# EasyEDA Pro project ProPrj_主车电路板.epro, schematic 12V&步进驱动&CAN收发
Board Name: 12V&步进驱动&CAN收发; Create Date: 2025-03-30; Page Name: P1; Project Name: 主车电路板3.0; Schematic Name: 12V&步进驱动&CAN收发; Update Date: 2025-04-13; Company: 嘉立创EDA; Drawed: 李子晞; Page Size: A4; Version: V1.0
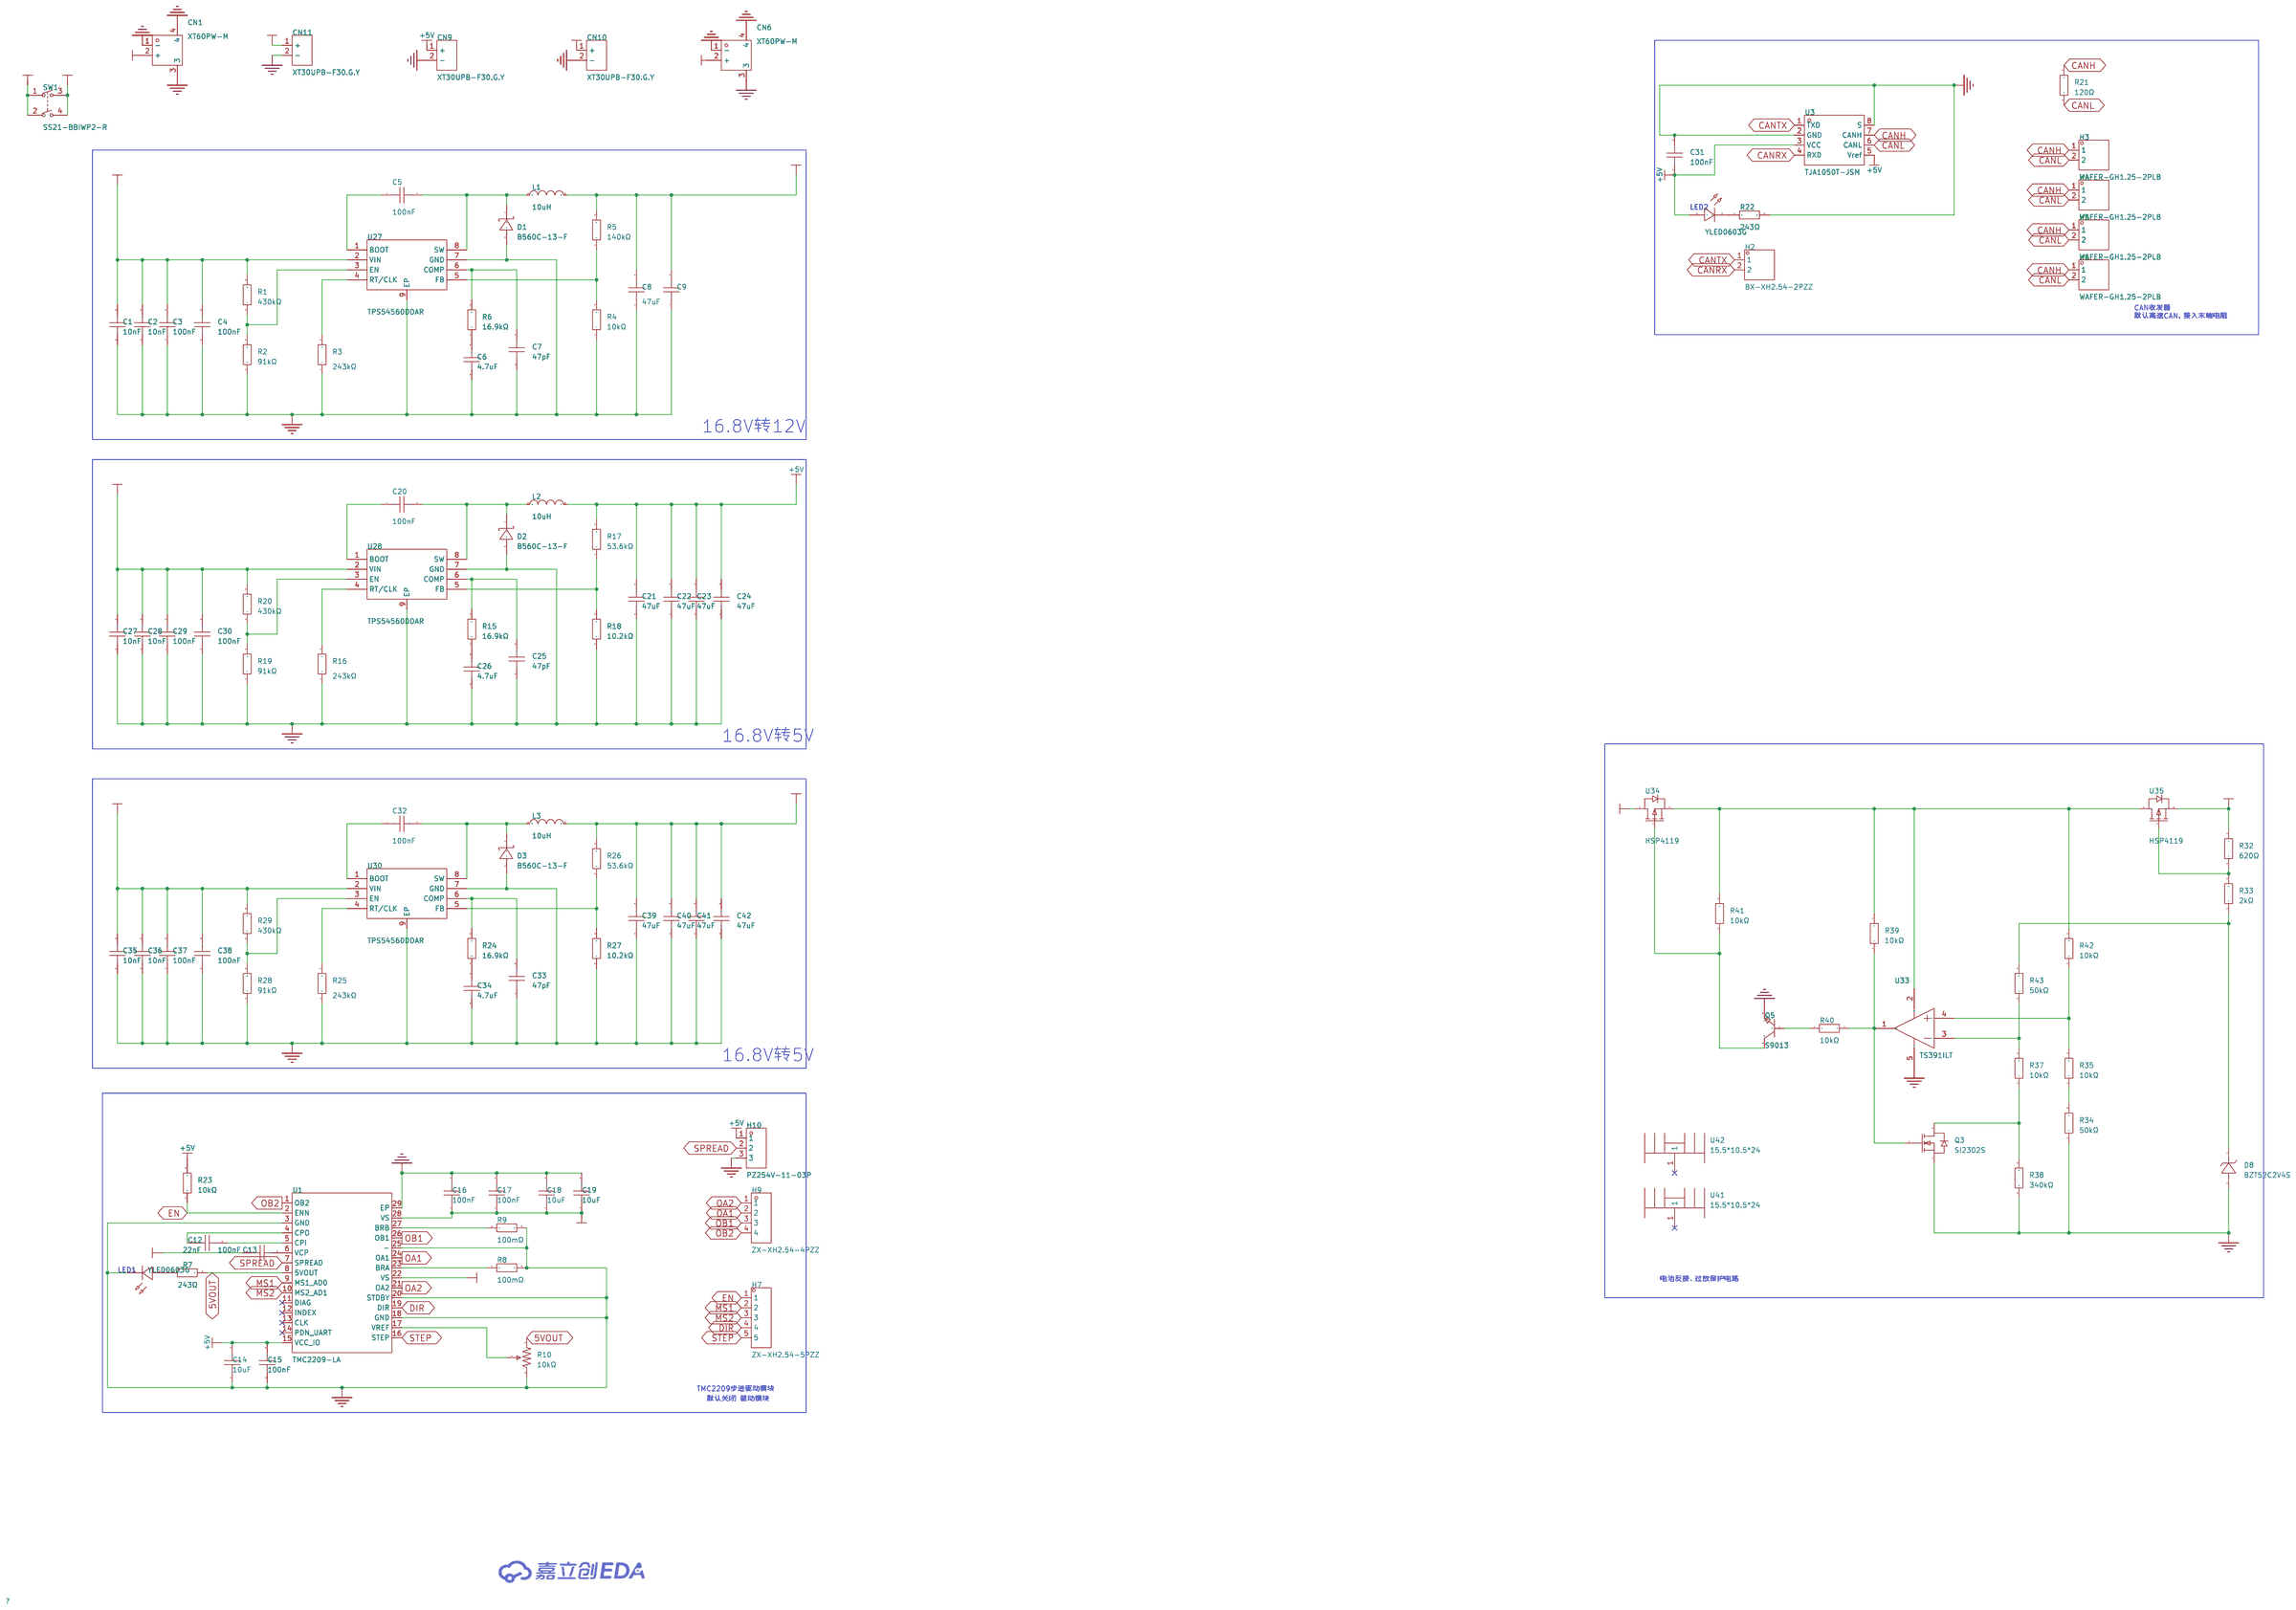
[diagram p0: schematic sheet]

## Parts
C1  10nF  [C0805]
C2  10nF  [C0805]
C3  100nF  [C0805]
C4  100nF  [C0805]
C5  100nF  [C0805]
C6  4.7uF  [C0805]
C7  47pF  [C0805]
C8  47uF  [CAP-SMD_BD6.3-L6.6-W6.6-LS7.2-FD]
C9  47uF  [CAP-SMD_BD6.3-L6.6-W6.6-LS7.2-FD]
C12  22nF  [C0805]
C13  100nF  [C0805]
C14  10uF  [C0805]
C15  100nF  [C0805]
C16  100nF  [C0805]
C17  100nF  [C0805]
C18  10uF  [C0805]
C19  10uF  [C0805]
C20  100nF  [C0805]
C21  47uF  [C1206]
C22  47uF  [C1206]
C23  47uF  [C1206]
C24  47uF  [C1206]
C25  47pF  [C0805]
C26  4.7uF  [C0805]
C27  10nF  [C0805]
C28  10nF  [C0805]
C29  100nF  [C0805]
C30  100nF  [C0805]
C31  100nF  [C0805]
C32  100nF  [C0805]
C33  47pF  [C0805]
C34  4.7uF  [C0805]
C35  10nF  [C0805]
C36  10nF  [C0805]
C37  100nF  [C0805]
C38  100nF  [C0805]
C39  47uF  [C1206]
C40  47uF  [C1206]
C41  47uF  [C1206]
C42  47uF  [C1206]
CN1  XT60PW-M  [CONN-TH_XT60PW-M]
CN6  XT60PW-M  [CONN-TH_XT60PW-M]
CN9  XT30UPB-F30.G.Y  [CONN-TH_XT30UPB-F]
CN10  XT30UPB-F30.G.Y  [CONN-TH_XT30UPB-F]
CN11  XT30UPB-F30.G.Y  [CONN-TH_XT30UPB-F]
D1  B560C-13-F  [SMC_L7.1-W6.2-LS8.1-RD]
D2  B560C-13-F  [SMC_L7.1-W6.2-LS8.1-RD]
D3  B560C-13-F  [SMC_L7.1-W6.2-LS8.1-RD]
D8  BZT52C2V4S  [SOD-323_L1.9-W1.3-LS2.5-RD-1]
H2  BX-XH2.54-2PZZ  [CONN-TH_2P-P2.50_BX-XH2.54-2PZZ]
H3  WAFER-GH1.25-2PLB  [CONN-TH_2P-P1.25_XUNPU_WAFER-GH1.25-2PLB]
H4  WAFER-GH1.25-2PLB  [CONN-TH_2P-P1.25_XUNPU_WAFER-GH1.25-2PLB]
H5  WAFER-GH1.25-2PLB  [CONN-TH_2P-P1.25_XUNPU_WAFER-GH1.25-2PLB]
H6  WAFER-GH1.25-2PLB  [CONN-TH_2P-P1.25_XUNPU_WAFER-GH1.25-2PLB]
H7  ZX-XH2.54-5PZZ  [CONN-TH_5P-P2.50_ZX-XH2.54-5PZZ]
H9  ZX-XH2.54-4PZZ  [CONN-TH_4P-P2.50_4PIN]
H10  PZ254V-11-03P  [HDR-TH_3P-P2.54-V-M]
L1  10uH  [IND-SMD_L7.3-W6.8]
L2  10uH  [IND-SMD_L7.3-W6.8]
L3  10uH  [IND-SMD_L7.3-W6.8]
LED1  YLED0603G  [LED0603-FD]
LED2  YLED0603G  [LED0603-FD]
Q3  SI2302S  [SOT-23-3_L2.9-W1.3-P1.90-LS2.4-BR]
Q5  S9013  [SOT-23-3_L2.9-W1.3-P0.95-LS2.4-BR]
R1  430kΩ  [R0805]
R2  91kΩ  [R0805]
R3  243kΩ  [R0805]
R4  10kΩ  [R0805]
R5  140kΩ  [R0805]
R6  16.9kΩ  [R0805]
R7  243Ω  [R0805]
R8  100mΩ  [R0805]
R9  100mΩ  [R0805]
R10  10kΩ  [RES-ADJ-SMD_3P-L3.0-W3.8-P1.75-BR]
R15  16.9kΩ  [R0805]
R16  243kΩ  [R0805]
R17  53.6kΩ  [R0805]
R18  10.2kΩ  [R0805]
R19  91kΩ  [R0805]
R20  430kΩ  [R0805]
R21  120Ω  [R0805]
R22  243Ω  [R0805]
R23  10kΩ  [R0805]
R24  16.9kΩ  [R0805]
R25  243kΩ  [R0805]
R26  53.6kΩ  [R0805]
R27  10.2kΩ  [R0805]
R28  91kΩ  [R0805]
R29  430kΩ  [R0805]
R32  620Ω  [R0805]
R33  2kΩ  [R0805]
R34  50kΩ  [R0805]
R35  10kΩ  [R0805]
R37  10kΩ  [R0805]
R38  340kΩ  [R0805]
R39  10kΩ  [R0805]
R40  10kΩ  [R0805]
R41  10kΩ  [R0805]
R42  10kΩ  [R0805]
R43  50kΩ  [R0805]
SW1  SS21-BBIWP2-R  [SW-TH_SS21-BBIWP2]
U1  TMC2209-LA  [QFN-28_L5.0-W5.0-P0.50-BL-EP]
U3  TJA1050T-JSM  [SOIC-8_L4.9-W3.9-P1.27-LS6.0-BL]
U27  TPS54560DDAR  [SOIC-8_L5.0-W4.0-P1.27-LS6.0-BL-EP2.0]
U28  TPS54560DDAR  [SOIC-8_L5.0-W4.0-P1.27-LS6.0-BL-EP2.0]
U30  TPS54560DDAR  [SOIC-8_L5.0-W4.0-P1.27-LS6.0-BL-EP2.0]
U33  TS391ILT  [SOT-23-5_L3.0-W1.7-P0.95-LS2.8-BR]
U34  HSP4119  [TO-220-3_L10.2-W4.5-P2.54-L]
U35  HSP4119  [TO-220-3_L10.2-W4.5-P2.54-L]
U41  15.5*10.5*24  [HEATSINK-TH_L15.5-W10.5-XSD1226-005]
U42  15.5*10.5*24  [HEATSINK-TH_L15.5-W10.5-XSD1226-005]

## Library data of the parts
C1 C2 C27 C28 C35 C36 = CC0805KRX7R9BB103: 容值:10nF;精度:±10%;额定电压:50V;材质(温度系数):X7R;; LCSC Part Name: 10nF ±10% 50V; Supplier Part: C83170; Manufacturer: YAGEO(国巨); Supplier Footprint: 0805; JLCPCB Part Class: Extended Part; Datasheet: https://atta.szlcsc.com/upload/public/pdf/source/20170211/1486785656773.pdf; Supplier: LCSC; Tolerance: ±10%; Voltage Rated: 50V; Temperature Coefficient: X7R
C3 C4 C13 C15-C17 C20 C29-C32 C37 C38 = CC0805KRX7R9BB104: 容值:100nF;精度:±10%;额定电压:50V;材质(温度系数):X7R;; LCSC Part Name: 100nF ±10% 50V; Supplier Part: C49678; Manufacturer: YAGEO(国巨); Supplier Footprint: 0805; JLCPCB Part Class: Basic Part; Datasheet: https://atta.szlcsc.com/upload/public/pdf/source/20180224/C181747_15194369449651363981.pdf; Supplier: LCSC; Tolerance: ±10%; Voltage Rated: 50V; Temperature Coefficient: X7R
C5 = CC0805JRX7R9BB104: 容值:100nF;精度:±5%;额定电压:50V;材质(温度系数):X7R;; LCSC Part Name: 100nF ±5% 50V; Supplier Part: C111492; Manufacturer: YAGEO(国巨); Supplier Footprint: 0805; JLCPCB Part Class: Extended Part; Datasheet: https://atta.szlcsc.com/upload/public/pdf/source/20170712/C111492_1499832266087814220.pdf; Supplier: LCSC; Tolerance: ±5%; Voltage Rated: 50V; Temperature Coefficient: X7R
C6 = CC0805KKX5R9BB475: 容值:4.7uF;精度:±10%;额定电压:50V;材质(温度系数):X5R;; LCSC Part Name: 4.7uF ±10% 50V; Supplier Part: C2897302; Manufacturer: YAGEO(国巨); Supplier Footprint: 0805; JLCPCB Part Class: Extended Part; Datasheet: https://atta.szlcsc.com/upload/public/pdf/source/20240708/74D7CC2672B7CD71C30ED4CACAE97037.pdf; Supplier: LCSC; Tolerance: ±10%; Voltage Rated: 50V; Temperature Coefficient: X5R
C7 C25 C33 = CC0805JRNPO9BN470: 容值:47pF;精度:±5%;额定电压:50V;材质(温度系数):NP0;; LCSC Part Name: 47pF ±5% 50V; Supplier Part: C107118; Manufacturer: YAGEO(国巨); Supplier Footprint: 0805; JLCPCB Part Class: Extended Part; Datasheet: https://atta.szlcsc.com/upload/public/pdf/source/20181008/C309499_21CC21451B82C39E3D92150FD6B30293.pdf; Supplier: LCSC; Tolerance: ±5%; Voltage Rated: 50V; Temperature Coefficient: NP0
C8 C9 = RVT47UF35V67RV0039: 容值:47uF;精度:±20%;额定电压:35V;纹波电流:16.4mA@120Hz;等效串联电阻(ESR):-;; LCSC Part Name: 47uF ±20% 35V; Supplier Part: C2836440; Manufacturer: KNSCHA(科尼盛); Supplier Footprint: SMD,D6.3xL5.4mm; JLCPCB Part Class: Extended Part; Datasheet: https://atta.szlcsc.com/upload/public/pdf/source/20210528/C2836440_FB61BB3A7A46B9CC2A608A35871DBF0C.pdf; Supplier: LCSC; Tolerance: ±20%; Voltage Rating: 35V; Ripple Current: 16.4mA@120Hz; Diameter: 6.3mm; Height - Seated (Max): 5.4mm; Lifetime: 2000hrs@105℃; Operating Temperature: -55℃~+105℃
C12 = CC0805KRX7R9BB223: 容值:22nF;精度:±10%;额定电压:50V;材质(温度系数):X7R;; LCSC Part Name: 22nF ±10% 50V; Supplier Part: C107147; Manufacturer: YAGEO(国巨); Supplier Footprint: 0805; JLCPCB Part Class: Extended Part; Datasheet: https://atta.szlcsc.com/upload/public/pdf/source/20170914/C128857_1505359892143968080.pdf; Supplier: LCSC; Tolerance: ±10%; Voltage Rated: 50V; Temperature Coefficient: X7R
C14 C18 C19 = CC0805KKX5R8BB106_C89831: 容值:10uF;精度:±10%;额定电压:25V;材质(温度系数):X5R;; LCSC Part Name: 10uF ±10% 25V; Supplier Part: C89831; Manufacturer: YAGEO(国巨); Manufacturer Part: CC0805KKX5R8BB106; Supplier Footprint: 0805; JLCPCB Part Class: Extended Part; Datasheet: https://atta.szlcsc.com/upload/public/pdf/source/20180403/C190190_A1AA8A0854FDD509EBDBDAD022A1C1DB.pdf; Supplier: LCSC; Tolerance: ±10%; Voltage Rated: 25V; Temperature Coefficient: X5R
C21-C24 C39-C42 = TCC1206X5R476M100HT: 容值:47uF;精度:±20%;额定电压:10V;温度系数:X5R;; LCSC Part Name: 47uF ±20% 10V; Supplier Part: C5448950; Manufacturer: CCTC(三环); Supplier Footprint: 1206; JLCPCB Part Class: Extended Part; Datasheet: https://atta.szlcsc.com/upload/public/pdf/source/20240328/884AC395F30D87665FEB597BCA413C3A.pdf; Supplier: LCSC; Tolerance: ±20%; Voltage Rating: 10V; Temperature Coefficient: X5R
C26 C34 = CGA0805X7R475K350MT: 容值:4.7uF;精度:±10%;额定电压:35V;材质(温度系数):X7R;; LCSC Part Name: 4.7uF ±10% 35V; Supplier Part: C6119943; Manufacturer: HRE(芯声); Supplier Footprint: 0805; JLCPCB Part Class: Extended Part; Supplier: LCSC; Tolerance: ±10%; Voltage Rated: 35V; Temperature Coefficient: X7R
CN1 CN6 = XT60PW-M: 类别:-;类型1:-;; LCSC Part Name: AMASS(艾迈斯)航模插头xt60连接器150公母对接pw锂电池公头 板插卧式XT60PW-M; Supplier Part: C98732; Manufacturer: AMASS(艾迈斯); JLCPCB Part Class: 扩展库; Datasheet: https://atta.szlcsc.com/upload/public/pdf/source/20240118/44A3DCFF53BE25DC65378AFFB21277A4.pdf; Supplier: LCSC; Brand: 艾迈斯; Type: 卧式插头; Colour: 黄色; InterfaceType: 公头
CN9-CN11 = XT30UPB-F30.G.Y: 类别:-;类型1:-;; LCSC Part Name: AMASS(艾迈斯)直立焊板式连接器XT30UPB30-F.G.*; Supplier Part: C108769; Manufacturer: AMASS(艾迈斯); JLCPCB Part Class: 扩展库; Datasheet: https://atta.szlcsc.com/upload/public/pdf/source/20220715/AFD68B9E8B6CA95A7295DBF4AF9325E4.pdf; Supplier: LCSC; Brand: 艾迈斯; Type: 航模插头; Colour: 黄色; RatedVoltage: DC 500V; InterfaceType: 母头; MetalMaterial: 镀金; InsulationMaterial: PA; RatedCurrent: 15A; contact resistance: 0.65mΩ
D1-D3 = B560C-13-F: 正向压降(Vf):700mV@5A;直流反向耐压(Vr):60V;整流电流:5A;; LCSC Part Name: 电压:60V 电流:5A; Supplier Part: C85100; Manufacturer: DIODES(美台); Supplier Footprint: SMC(DO-214AB); JLCPCB Part Class: 扩展库; Datasheet: https://atta.szlcsc.com/upload/public/pdf/source/20171023/C134461_15087453602301052556.pdf; Supplier: LCSC; Forward Voltage (Vf@If): 700mV@5A; Reverse Voltage (Vr): 60V; Rectified Current: 5A; Reverse Leakage Current (Ir): 500uA@60V
D8 = BZT52C2V4S_C22375290: 二极管配置:独立式;稳压值(标称值):2.4V;稳压值(范围):2.2V~2.6V;功率(Pd):200mW;; Supplier Part: C22375290; Manufacturer: 宏迦橙; Supplier Footprint: SOD-323; JLCPCB Part Class: 扩展库; Datasheet: https://atta.szlcsc.com/upload/public/pdf/source/20240429/5D32C25DF9220690D27DBBD9463ECD1D.pdf; Supplier: LCSC; Diode Configuration: 独立式; Zener Voltage (Nom): 2.4V; Reverse Leakage Current (Ir): 50uA@1V; Zener Voltage (Range): 2.2V~2.6V; Power Dissipation: 200mW; Zener Impedance (Zzt): 100Ω
H2 = BX-XH2.54-2PZZ: 插针结构:1x2P;间距:2.5mm;安装方式:直插;参考系列:XH;总PIN数:2P;排数:1;每排PIN数:2;行距:-;额定电流:3A;触头材质:黄铜;触头镀层:锡;工作温度:-25℃~+85℃;; LCSC Part Name: 1x2P 间距:2.5mm 直插 系列:XH; Supplier Part: C18077833; Manufacturer: Bossie(博锡); Supplier Footprint: 插件,P=2.54mm; JLCPCB Part Class: Extended Part; Datasheet: https://atta.szlcsc.com/upload/public/pdf/source/20231017/CB25E46A13930659CD6CDE2F2553A508.pdf; Supplier: LCSC; Pins Structure: 1x2P; Pitch: 2.5mm; Mounting Type: 直插; Reference Series: XH; Number of Pins: 2P; Number of Rows: 1; Number of PINs Per Row: 2; Current Rating: 3A; Contact Material: 黄铜; Contact Plating: 锡; Operating Temperature: -25℃~+85℃; Voltage Rating: 250V; Plastic Material: PA66; Flame Retardant Rating: UL94V-0; Color: 白色; Z-Height of the Board: 7mm; X-Length of Bottom Edge on Board (Spacing Line): 7.5mm; Y-Width of Bottom Edge on Board: 5.9mm
H3-H6 = WAFER-GH1.25-2PLB: 插针结构:1x2P;间距:1.25mm;安装方式:立贴;参考系列:GH;总PIN数:2P;排数:1;每排PIN数:2;行距:-;额定电流:1A;触头材质:黄铜;触头镀层:-;工作温度范围:-25℃~+85℃;; LCSC Part Name: 1x2P 间距:1.25mm 立贴 系列:GH; Supplier Part: C3029368; Manufacturer: XUNPU(讯普); Supplier Footprint: SMD,P=1.25mm; JLCPCB Part Class: Extended Part; Datasheet: https://atta.szlcsc.com/upload/public/pdf/source/20220527/44F824AAC8C2B617205E15955FF9C23D.pdf; Supplier: LCSC; Pins Structure: 1x2P; Pitch: 1.25mm; Mounting Type: 立贴; Reference Series: GH; Number of Pins: 2P; Number of Rows: 1; Number of PINs Per Row: 2; Current Rating: 1A; Contact Material: 黄铜; Operating Temperature: -25℃~+85℃; Voltage Rating: 125V; Plastic Material: LCP; Supplementary Features: 辅助焊脚; Color: 米色; Z-Height of the Board: 4.2mm; X-Length of Bottom Edge on Board (Spacing Line): 5.75mm; Y-Width of Bottom Edge on Board: 4.95mm
H7 = ZX-XH2.54-5PZZ: 插针结构:1x5P;间距:2.5mm;安装方式:直插;参考系列:XH;总PIN数:5P;排数:1;每排PIN数:5;行距:-;额定电流:3A;触头材质:黄铜;触头镀层:锡;工作温度范围:-25℃~+85℃;; LCSC Part Name: 1x5P 间距:2.5mm 直插 系列:XH; Supplier Part: C7429635; Manufacturer: Megastar(兆星); Supplier Footprint: 插件,P=2.5mm; JLCPCB Part Class: Extended Part; Datasheet: https://atta.szlcsc.com/upload/public/pdf/source/20230619/60EEF4ADD558E90BFFACF5D939816781.pdf; Supplier: LCSC; Pins Structure: 1x5P; Pitch: 2.5mm; Mounting Type: 直插; Reference Series: XH; Number of Pins: 5P; Number of Rows: 1; Number of PINs Per Row: 5; Rated Current: 3A; Contact Material: 黄铜; Contact Plating: 锡; Operating Temperature: -25℃~+85℃; Rated Voltage (Max): 250V; Plastic Material: PA66; Flame Retardant Rating: UL94V-0; Color: 白色; Z-Height of the Board: 7mm; X-Length of Bottom Edge on Board (Spacing Line): 15mm; Y-Width of Bottom Edge on Board: 5.9mm
H9 = ZX-XH2.54-4PZZ: 插针结构:1x4P;间距:2.5mm;安装方式:直插;参考系列:XH;总PIN数:4P;排数:1;每排PIN数:4;行距:-;额定电流:3A;触头材质:黄铜;触头镀层:锡;工作温度范围:-25℃~+85℃;; LCSC Part Name: 1x4P 间距:2.5mm 直插 系列:XH; Supplier Part: C7429634; Manufacturer: Megastar(兆星); Supplier Footprint: 插件,P=2.5mm; JLCPCB Part Class: Extended Part; Datasheet: https://atta.szlcsc.com/upload/public/pdf/source/20230619/B529A2163E0159A644AB3383D208FB03.pdf; Supplier: LCSC; Pins Structure: 1x4P; Pitch: 2.5mm; Mounting Type: 直插; Reference Series: XH; Number of Pins: 4P; Number of Rows: 1; Number of PINs Per Row: 4; Rated Current: 3A; Contact Material: 黄铜; Contact Plating: 锡; Operating Temperature: -25℃~+85℃; Rated Voltage (Max): 250V; Plastic Material: PA66; Flame Retardant Rating: UL94V-0; Color: 白色; Z-Height of the Board: 7mm; X-Length of Bottom Edge on Board (Spacing Line): 12.5mm; Y-Width of Bottom Edge on Board: 5.9mm
H10 = PZ254V-11-03P: 插针结构:1x3P;间距:2.54mm;行距:-;圆针/方针:方针;安装方式:直插;排数:单排;总PIN位数:3P;额定电流:3A;额定电压:250V;配合针长度:6mm;塑高:2.5mm;端接针长度:3mm;工作温度:-40℃~+105℃;颜色:黑色;; LCSC Part Name: 1x3P 间距:2.54mm 方针 直插; Supplier Part: C2937625; Manufacturer: XFCN(兴飞); Supplier Footprint: 插件,P=2.54mm; JLCPCB Part Class: Extended Part; Datasheet: https://atta.szlcsc.com/upload/public/pdf/source/20200309/C492402_8335C3D49C4E4C618838D59BB1D024C1.pdf; Supplier: LCSC; Pin Structure: 1x3P; Pitch: 2.54mm; Circluar Pins/Square Pins: 方针; Mounting Type: 直插; Number of Rows: 单排; Number of Pins: 3P; Current Rating: 3A; Voltage Rating (Max): 250V; Length of Mating Pin: 6mm; Insulation Height: 2.5mm; Length of End Connection Pin: 3mm; Operating Temperature: -40℃~+105℃; Color: 黑色
L1-L3 = FXL0630-100-M: 电感值:10uH;精度:±20%;额定电流:4.5A;饱和电流(Isat):5.5A;类型:一体成型电感;; LCSC Part Name: 10uH ±20% 5.5A; Supplier Part: C167223; Manufacturer: cjiang(长江微电); Supplier Footprint: SMD,6.6x7mm; JLCPCB Part Class: Extended Part; Datasheet: https://atta.szlcsc.com/upload/public/pdf/source/20240426/3189EA8206330E2108542F9E34E540E7.pdf; Supplier: LCSC; Tolerance: ±20%; Rated Current: 4.5A; Saturation Current (Isat): 5.5A; DC Resistance (DCR): 68mΩ; Type: 一体成型电感
LED1 LED2 = YLED0603G: 发光颜色:翠绿色;正向电压(VF):2.7V~3.2V;功率:-;正向电流:25mA;主波长:510nm~531nm;二极管配置:-;透镜颜色:-;色温:-;发光强度:-;发光角度:-;载带方式:-;工作温度:-40℃~+85℃;; Supplier Part: C19273151; Manufacturer: YONGYUTAI(永裕泰); Supplier Footprint: 0603; JLCPCB Part Class: Extended Part; Datasheet: https://atta.szlcsc.com/upload/public/pdf/source/20231201/6896CD173B7817C61CFF421DECB2B9C4.pdf; Supplier: LCSC; Emitted Color: 翠绿色; Forward Voltage (VF): 2.7V~3.2V; Forward Current: 25mA; Dominant Wavelength: 510nm~531nm; Operating Temperature: -40℃~+85℃
Q3 = SI2302S_C22463594: 1个N沟道 耐压:20V 电流:2.1A适用于电源开关和信号控制; LCSC Part Name: 1个N沟道 耐压:20V 电流:2.1A; Supplier Part: C22463594; Manufacturer: GOODWORK(固得沃克); Supplier Footprint: SOT-23; JLCPCB Part Class: 扩展库; Datasheet: https://atta.szlcsc.com/upload/public/pdf/source/20240611/E535E246C05F34674EAAB47AAA6826F4.pdf; Supplier: LCSC
Q5 = S9013_C20069127: 晶体管类型:NPN;集电极电流(Ic):500mA;集射极击穿电压(Vceo):25V;耗散功率(Pd):300mW;直流电流增益(hFE):120@50mA,1.0V;; LCSC Part Name: hFE:200-350，丝印:J3 S9013; Supplier Part: C20069127; Manufacturer: 宏嘉诚; Supplier Footprint: SOT-23; JLCPCB Part Class: 扩展库; Datasheet: https://atta.szlcsc.com/upload/public/pdf/source/20250205/51C608C702E5E8D56ABAF01312979A4C.pdf; Supplier: LCSC; type: NPN; Current - Collector(Ic): 500mA; Collector - Emitter Voltage VCEO: 25V; Pd - Power Dissipation: 300mW; DC Current Gain: 120@50mA,1.0V; Transition frequency(fT): 150MHz; Current - Collector Cutoff: 100nA; Vce Saturation(VCE(sat)): 600mV; Operating Temperature: -55℃~+150℃
R1 = RC0805FR-07430KL: 电阻类型:厚膜电阻;阻值:430kΩ;精度:±1%;功率:125mW;最大工作电压:150V;温度系数:±100ppm/℃;; LCSC Part Name: 厚膜电阻 430kΩ ±1% 125mW; Supplier Part: C185287; Manufacturer: YAGEO(国巨); Supplier Footprint: 0805; JLCPCB Part Class: Extended Part; Datasheet: https://atta.szlcsc.com/upload/public/pdf/source/20180904/C276339_014E484F1DBA106FB92D45EABD5A1AC1.pdf; Supplier: LCSC; Type: 厚膜电阻; Tolerance: ±1%; Power(Watts): 125mW; Overload Voltage (Max): 150V; Temperature Coefficient: ±100ppm/℃; Operating Temperature Range: -55℃~+155℃
R2 = RC0805FR-0791KL: 电阻类型:厚膜电阻;阻值:91kΩ;精度:±1%;功率:125mW;最大工作电压:150V;温度系数:±100ppm/℃;; LCSC Part Name: 厚膜电阻 91kΩ ±1% 125mW; Supplier Part: C137484; Manufacturer: YAGEO(国巨); Supplier Footprint: 0805; JLCPCB Part Class: Extended Part; Datasheet: https://atta.szlcsc.com/upload/public/pdf/source/20180821/C275644_0D56F95EFF785E7D9A1FEF436B37DA78.pdf; Supplier: LCSC; Type: 厚膜电阻; Tolerance: ±1%; Power(Watts): 125mW; Overload Voltage (Max): 150V; Temperature Coefficient: ±100ppm/℃; Operating Temperature Range: -55℃~+155℃
R3 = RC0805FR-07243KL: 电阻类型:厚膜电阻;阻值:243kΩ;精度:±1%;功率:125mW;最大工作电压:150V;温度系数:±100ppm/℃;; LCSC Part Name: 厚膜电阻 243kΩ ±1% 125mW; Supplier Part: C273923; Manufacturer: YAGEO(国巨); Supplier Footprint: 0805; JLCPCB Part Class: Extended Part; Datasheet: https://atta.szlcsc.com/upload/public/pdf/source/20191125/C364360_EA870FADD46A2AD4DBE56DD50D360B3E.pdf; Supplier: LCSC; Type: 厚膜电阻; Tolerance: ±1%; Power(Watts): 125mW; Overload Voltage (Max): 150V; Temperature Coefficient: ±100ppm/℃; Operating Temperature Range: -55℃~+155℃
R4 R23 R39-R41 = RC0805FR-0710KL: 电阻类型:厚膜电阻;阻值:10kΩ;精度:±1%;功率:125mW;最大工作电压:150V;温度系数:±100ppm/℃;; LCSC Part Name: 厚膜电阻 10kΩ ±1% 125mW; Supplier Part: C84376; Manufacturer: YAGEO(国巨); Supplier Footprint: 0805; JLCPCB Part Class: Extended Part; Datasheet: https://atta.szlcsc.com/upload/public/pdf/source/20170708/1499509500945.pdf; Supplier: LCSC; Type: 厚膜电阻; Tolerance: ±1%; Power(Watts): 125mW; Overload Voltage (Max): 150V; Temperature Coefficient: ±100ppm/℃; Operating Temperature Range: -55℃~+155℃
R5 = RC0805FR-07140KL: 电阻类型:厚膜电阻;阻值:140kΩ;精度:±1%;功率:125mW;最大工作电压:150V;温度系数:±100ppm/℃;; LCSC Part Name: 厚膜电阻 140kΩ ±1% 125mW; Supplier Part: C273833; Manufacturer: YAGEO(国巨); Supplier Footprint: 0805; JLCPCB Part Class: Extended Part; Datasheet: https://atta.szlcsc.com/upload/public/pdf/source/20191125/C364360_EA870FADD46A2AD4DBE56DD50D360B3E.pdf; Supplier: LCSC; Type: 厚膜电阻; Tolerance: ±1%; Power(Watts): 125mW; Overload Voltage (Max): 150V; Temperature Coefficient: ±100ppm/℃; Operating Temperature Range: -55℃~+155℃
R6 R15 R24 = AR05BTCW1692: 阻值:16.9kΩ;精度:±0.1%;功率:125mW;温度系数:±25ppm/℃;; LCSC Part Name: 16.9kΩ ±0.1% 125mW; Supplier Part: C515721; Manufacturer: Viking(光颉); Supplier Footprint: 0805; JLCPCB Part Class: Extended Part; Datasheet: https://atta.szlcsc.com/upload/public/pdf/source/20200713/C515721_70E83D7F66B4D04E89B351F6154A36BE.pdf; Supplier: LCSC; Tolerance: ±0.1%; Power(Watts): 125mW; Temperature Coefficient: ±25ppm/℃
R7 R22 = RC0805FR-07243RL: 电阻类型:厚膜电阻;阻值:243Ω;精度:±1%;功率:125mW;最大工作电压:150V;温度系数:±100ppm/℃;; LCSC Part Name: 厚膜电阻 243Ω ±1% 125mW; Supplier Part: C295889; Manufacturer: YAGEO(国巨); Supplier Footprint: 0805; JLCPCB Part Class: Extended Part; Datasheet: https://atta.szlcsc.com/upload/public/pdf/source/20191125/C364360_EA870FADD46A2AD4DBE56DD50D360B3E.pdf; Supplier: LCSC; Type: 厚膜电阻; Tolerance: ±1%; Power(Watts): 125mW; Overload Voltage (Max): 150V; Temperature Coefficient: ±100ppm/℃; Operating Temperature Range: -55℃~+155℃
R8 R9 = RL0805FR-070R1L: 电阻类型:厚膜电阻;阻值:100mΩ;精度:±1%;功率:125mW;温度系数:±600ppm/℃;; LCSC Part Name: 厚膜电阻 100mΩ ±1% 125mW; Supplier Part: C327210; Manufacturer: YAGEO(国巨); Supplier Footprint: 0805; JLCPCB Part Class: Extended Part; Datasheet: https://atta.szlcsc.com/upload/public/pdf/source/20190117/C364358_8D23EBEF8D6114A58E9E609394FA067B.pdf; Supplier: LCSC; Type: 厚膜电阻; Tolerance: ±1%; Power(Watts): 125mW; Temperature Coefficient: ±600ppm/℃; Operating Temperature Range: -55℃~+155℃
R10 = TC33X-2-103E: 阻值:10kΩ;精度:±25%;功率:150mW;温度系数:±250ppm/℃;; LCSC Part Name: 10kΩ ±25%; Supplier Part: C719176; Manufacturer: BOURNS; Supplier Footprint: SMD-3P,3.8x3.6mm; JLCPCB Part Class: 扩展库; Datasheet: https://atta.szlcsc.com/upload/public/pdf/source/20200810/C720646_BB66A75E654D5E1D30127FF45BCD3C26.pdf; Supplier: LCSC; Tolerance: ±25%; Power(Watts): 150mW; Temperature Coefficient: ±250ppm/℃; Turns: 1
R16 R25 = PTFR0805B243KP9: 电阻类型:薄膜电阻;阻值:243kΩ;精度:±0.1%;功率:130mW;工作电压:150V;温度系数:±25ppm/℃;; LCSC Part Name: 薄膜电阻 243kΩ ±0.1% 130mW; Supplier Part: C2849120; Manufacturer: RESI(开步睿思); Supplier Footprint: 0805; JLCPCB Part Class: Extended Part; Datasheet: https://atta.szlcsc.com/upload/public/pdf/source/20240506/11BDC7478D84177AC2A5326A65B6EB29.pdf; Supplier: LCSC; Type: 薄膜电阻; Tolerance: ±0.1%; Power(Watts): 130mW; Voltage-Supply(Max): 150V; Temperature Coefficient: ±25ppm/℃; Operating Temperature: -55℃~+155℃
R17 R26 = PTFR0805B53K6P9: 电阻类型:薄膜电阻;阻值:53.6kΩ;精度:±0.1%;功率:130mW;最大工作电压:150V;温度系数:±25ppm/℃;; LCSC Part Name: 薄膜电阻 53.6kΩ ±0.1% 130mW; Supplier Part: C2849269; Manufacturer: RESI(开步睿思); Supplier Footprint: 0805; JLCPCB Part Class: Extended Part; Datasheet: https://atta.szlcsc.com/upload/public/pdf/source/20240506/11BDC7478D84177AC2A5326A65B6EB29.pdf; Supplier: LCSC; Type: 薄膜电阻; Tolerance: ±0.1%; Power(Watts): 130mW; Overload Voltage (Max): 150V; Temperature Coefficient: ±25ppm/℃; Operating Temperature Range: -55℃~+155℃
R18 R27 = PTFR0805B10K2N9: 电阻类型:薄膜电阻;阻值:10.2kΩ;精度:±0.1%;功率:130mW;最大工作电压:150V;温度系数:±10ppm/℃;; LCSC Part Name: 薄膜电阻 10.2kΩ ±0.1% 130mW; Supplier Part: C2692777; Manufacturer: RESI(开步睿思); Supplier Footprint: 0805; JLCPCB Part Class: Extended Part; Datasheet: https://atta.szlcsc.com/upload/public/pdf/source/20240506/11BDC7478D84177AC2A5326A65B6EB29.pdf; Supplier: LCSC; Type: 薄膜电阻; Tolerance: ±0.1%; Power(Watts): 130mW; Overload Voltage (Max): 150V; Temperature Coefficient: ±10ppm/℃; Operating Temperature Range: -55℃~+125℃
R19 R28 = PTFR0805B91K0N9: 电阻类型:薄膜电阻;阻值:91kΩ;精度:±0.1%;功率:130mW;最大工作电压:150V;温度系数:±10ppm/℃;; LCSC Part Name: 薄膜电阻 91kΩ ±0.1% 130mW; Supplier Part: C351541; Manufacturer: RESI(开步睿思); Supplier Footprint: 0805; JLCPCB Part Class: Extended Part; Datasheet: https://atta.szlcsc.com/upload/public/pdf/source/20240506/11BDC7478D84177AC2A5326A65B6EB29.pdf; Supplier: LCSC; Type: 薄膜电阻; Tolerance: ±0.1%; Power(Watts): 130mW; Overload Voltage (Max): 150V; Temperature Coefficient: ±10ppm/℃; Operating Temperature Range: -55℃~+125℃
R20 R29 = PTFR0805B430KN9: 电阻类型:薄膜电阻;阻值:430kΩ;精度:±0.1%;功率:130mW;最大工作电压:150V;温度系数:±10ppm/℃;; LCSC Part Name: 薄膜电阻 430kΩ ±0.1% 130mW; Supplier Part: C351566; Manufacturer: RESI(开步睿思); Supplier Footprint: 0805; JLCPCB Part Class: Extended Part; Datasheet: https://atta.szlcsc.com/upload/public/pdf/source/20240506/11BDC7478D84177AC2A5326A65B6EB29.pdf; Supplier: LCSC; Type: 薄膜电阻; Tolerance: ±0.1%; Power(Watts): 130mW; Overload Voltage (Max): 150V; Temperature Coefficient: ±10ppm/℃; Operating Temperature Range: -55℃~+125℃
R21 = RC0805FR-07120RL: 电阻类型:厚膜电阻;阻值:120Ω;精度:±1%;功率:125mW;最大工作电压:150V;温度系数:±100ppm/℃;; LCSC Part Name: 厚膜电阻 120Ω ±1% 125mW; Supplier Part: C114245; Manufacturer: YAGEO(国巨); Supplier Footprint: 0805; JLCPCB Part Class: Extended Part; Datasheet: https://atta.szlcsc.com/upload/public/pdf/source/20180821/C275644_0D56F95EFF785E7D9A1FEF436B37DA78.pdf; Supplier: LCSC; Type: 厚膜电阻; Tolerance: ±1%; Power(Watts): 125mW; Overload Voltage (Max): 150V; Temperature Coefficient: ±100ppm/℃; Operating Temperature Range: -55℃~+155℃
R32 = 0805W8F6200T5E: 电阻类型:厚膜电阻;阻值:620Ω;精度:±1%;功率:125mW;最大工作电压:150V;温度系数:±100ppm/℃;; LCSC Part Name: 620Ω ±1% 125mW 厚膜电阻; Supplier Part: C17782; Manufacturer: UNI-ROYAL(厚声); Supplier Footprint: 0805; JLCPCB Part Class: Extended Part; Datasheet: https://atta.szlcsc.com/upload/public/pdf/source/20200306/C422600_1E6D84923E4A46A82E41ADD87F860B5C.pdf; Supplier: LCSC; Type: 厚膜电阻; Tolerance: ±1%; Power(Watts): 125mW; Overload Voltage (Max): 150V; Temperature Coefficient: ±100ppm/℃; Operating Temperature Range: -55℃~+155℃
R33 = 0805W8F2001T5E: 电阻类型:厚膜电阻;阻值:2kΩ;精度:±1%;功率:125mW;最大工作电压:150V;温度系数:±100ppm/℃;; LCSC Part Name: 2kΩ ±1% 125mW 厚膜电阻; Supplier Part: C17604; Manufacturer: UNI-ROYAL(厚声); Supplier Footprint: 0805; JLCPCB Part Class: Basic Part; Datasheet: https://atta.szlcsc.com/upload/public/pdf/source/20200306/C422600_1E6D84923E4A46A82E41ADD87F860B5C.pdf; Supplier: LCSC; Type: 厚膜电阻; Tolerance: ±1%; Power(Watts): 125mW; Overload Voltage (Max): 150V; Temperature Coefficient: ±100ppm/℃; Operating Temperature Range: -55℃~+155℃
R34 R43 = AR05BTCW5002: 电阻类型:薄膜电阻;阻值:50kΩ;精度:±0.1%;功率:125mW;最大工作电压:100V;温度系数:±25ppm/℃;; LCSC Part Name: 薄膜电阻 50kΩ ±0.1% 125mW; Supplier Part: C316211; Manufacturer: Viking(光颉); Supplier Footprint: 0805; JLCPCB Part Class: Extended Part; Datasheet: https://atta.szlcsc.com/upload/public/pdf/source/20181023/C316211_5E3B1DD8AC66E60BF05A8B1CCEE8EB5B.pdf; Supplier: LCSC; Type: 薄膜电阻; Tolerance: ±0.1%; Power(Watts): 125mW; Overload Voltage (Max): 100V; Temperature Coefficient: ±25ppm/℃; Operating Temperature Range: -55℃~+155℃
R35 R37 R42 = RT0805BRD0710KL: 电阻类型:薄膜电阻;阻值:10kΩ;精度:±0.1%;功率:125mW;最大工作电压:150V;温度系数:±25ppm/℃;; LCSC Part Name: 薄膜电阻 10kΩ ±0.1% 125mW; Supplier Part: C110775; Manufacturer: YAGEO(国巨); Supplier Footprint: 0805; JLCPCB Part Class: Extended Part; Datasheet: https://atta.szlcsc.com/upload/public/pdf/source/20171026/C133380_15089840010201058857.pdf; Supplier: LCSC; Type: 薄膜电阻; Tolerance: ±0.1%; Power(Watts): 125mW; Overload Voltage (Max): 150V; Temperature Coefficient: ±25ppm/℃; Operating Temperature Range: -55℃~+155℃
R38 = SCR0805F340K: 电阻类型:厚膜电阻;阻值:340kΩ;精度:±1%;功率:125mW;最大工作电压:150V;; LCSC Part Name: 厚膜电阻 340kΩ ±1% 125mW; Supplier Part: C3016829; Manufacturer: VO(翔胜); Supplier Footprint: 0805; JLCPCB Part Class: Extended Part; Datasheet: https://atta.szlcsc.com/upload/public/pdf/source/20220513/247AF9639BA21CF93567DC289CCC6A22.pdf; Supplier: LCSC; Type: 厚膜电阻; Tolerance: ±1%; Power(Watts): 125mW; Overload Voltage (Max): 150V; Operating Temperature Range: -55℃~+155℃
SW1 = SS21-BBIWP2-R: 带灯:-;引脚样式:焊片;额定电流:10A;额定电压(AC):250V;额定电压(DC):-;电路结构:双刀单掷;机械寿命:-;; LCSC Part Name: 跷板开关DPST 15x21mm; Supplier Part: C309182; Manufacturer: Legion(六钧); Supplier Footprint: 插件; JLCPCB Part Class: 扩展库; Datasheet: https://atta.szlcsc.com/upload/public/pdf/source/20190311/C309182_BE3155CDE2291F8D537E9264D9294CC5.pdf; Supplier: LCSC; Actuator Type: 凹面弯曲; Pin Style: 焊片; Actuator Color: 黑色; Contact Current: 10A; Voltage Rating (AC): 250V; Circuit: 双刀单掷; Actuator Identifier: - O
U1 = TMC2209-LA: Supplier Part: C465949; Manufacturer: TRINAMIC; Supplier Footprint: QFN-28-EP(5x5); JLCPCB Part Class: 扩展库; Datasheet: https://atta.szlcsc.com/upload/public/pdf/source/20191203/C465949_E563A3313F5F3F9C62E6E946672F7886.pdf; Supplier: LCSC; Technology: 是; Voltage - Supply: 4.75V~29V; Output Current: 2.8A; Interface: STEP/DIR；UART; Step Resolution: 256; RDS(on): 170mΩ; Peak Current: 2.8A; Operating Temperature: -40℃~+125℃
U3 = TJA1050T-JSM: 数据速率:1Mbps;; LCSC Part Name: TJA1050T; Supplier Part: C21714366; Manufacturer: JSMSEMI(杰盛微); Supplier Footprint: SOP-8; JLCPCB Part Class: 扩展库; Datasheet: https://atta.szlcsc.com/upload/public/pdf/source/20240307/226A42A673340FFB74D7F8B5A383F6D1.pdf; Supplier: LCSC; Data Rate: 1Mbps; Supply Voltage: 4.5V~5.5V; Operating Temperature: -40℃~+150℃
U27 U28 U30 = TPS54560DDAR: 功能类型:降压型;输出类型:可调;工作电压:4.5V~60V;输出电压:800mV~58.8V;输出电流:5A;; LCSC Part Name: 4.5V至60V输入,5A降压DC-DC转换器; Supplier Part: C31966; Manufacturer: TI(德州仪器); Supplier Footprint: SOIC-8-EP; JLCPCB Part Class: 扩展库; Datasheet: https://www.ti.com/cn/lit/gpn/tps54560; Supplier: LCSC; Function: 降压型; Output Type: 可调; Input Voltage: 4.5V~60V; Output Voltage: 800mV~58.8V; Output Current: 5A; Switching Frequency: 2.5MHz; Operating Temperature: -40℃~+150℃@(TJ); Synchronous Rectification: 否; Number of Outputs: 1; Topology: 降压式; Switch tube (built-in/external): 内置
U33 = TS391ILT: 输入失调电压(Vos):5mV;输入偏置电流(Ib):250nA;; LCSC Part Name: 低功耗单电源电压比较器; Supplier Part: C71896; Manufacturer: ST(意法半导体); Supplier Footprint: SOT-23-5; JLCPCB Part Class: 扩展库; Datasheet: https://atta.szlcsc.com/upload/public/pdf/source/20181030/C283306_6DA652FA5B58841E3373B14EFE3FA50C.pdf; Supplier: LCSC; Input Offset Voltage (Vos): 5mV; Input Bias Current (Ib): 250nA; Supply Voltage: 1V~18V；2V~36V; Output Type: 开集; Output Mode: DTL；TTL；CMOS；ECL; Supply Current: 1.25mA; Operating Temperature: -40℃~+125℃
U34 U35 = HSP4119: 类型:1个P沟道;漏源电压(Vdss):40V;连续漏极电流(Id):150A;导通电阻(RDS(on)):4.5mΩ@10V,30A;耗散功率(Pd):200W;阈值电压(Vgs(th)):2.5V;; LCSC Part Name: 1个P沟道 耐压:40V 电流:150A; Supplier Part: C22359313; Manufacturer: HUASHUO(华朔); Supplier Footprint: TO-220; JLCPCB Part Class: 扩展库; Datasheet: https://atta.szlcsc.com/upload/public/pdf/source/20240313/357887FEF42F886092AF64C6D762072D.pdf; Supplier: LCSC; Type: 1个P沟道; Drain to Source Voltage: 40V; Current - Continuous Drain(Id): 150A; RDS(on): 4.5mΩ@10V,30A; Pd - Power Dissipation: 200W; Gate Threshold Voltage (Vgs(th)@Id): 2.5V; Gate Charge(Qg): 190nC@10V; Input Capacitance(Ciss@Vds): 10.7nF@20V; Reverse Transfer Capacitance (Crss@Vds): 660pF@20V; Operating Temperature: -55℃~+150℃@(Tj)
U41 U42 = 15.5*10.5*24: 产品尺寸:15.5*10.5*24MM;材 质:6063-T5;; LCSC Part Name: 散热片15.5*10.5*24 带针 H型; Supplier Part: C108928; Manufacturer: XSD(鑫顺达); JLCPCB Part Class: 扩展库; Datasheet: https://atta.szlcsc.com/upload/public/pdf/source/20180614/C108928_606EC6D8E4D943F4065E73A7656775A1.pdf; Supplier: LCSC; ProductSize: 15.5*10.5*24MM; Colour: 白色; TextureOfMaterial: 6063-T5; SurfaceTreatment: 本色洗白; Shape: H型; type: -；-；-；-；-；-；-

## Nets
5VOUT: R7.2 R10.1 U1.8(5VOUT)
+5V: C14.2 C15.2 C21.2 C22.2 C23.2 C24.2 C31.1 CN9.1(+) H10.1 L2.2 LED2.2(A) R17.2 R23.2 U1.15(VCC_IO) U3.3(VCC) U3.5(Vref)
+12V: C8.2 C9.2 C13.1 C16.1 C17.1 C18.1 C19.1 L1.2 R5.2 U1.22(VS) U1.28(VS)
+16.8V: C1.2 C2.2 C3.2 C4.2 C27.2 C28.2 C29.2 C30.2 C35.2 C36.2 C37.2 C38.2 CN6.2(+) CN11.1(+) R1.2 R20.2 R29.2 U27.2(VIN) U28.2(VIN) U30.2(VIN) U34.2(D)
GND: C1.1 C2.1 C3.1 C4.1 C6.1 C7.1 C8.1 C9.1 C14.1 C15.1 C16.2 C17.2 C18.2 C19.2 C21.1 C22.1 C23.1 C24.1 C25.1 C26.1 C27.1 C28.1 C29.1 C30.1 C31.2 C33.1 C34.1 C35.1 C36.1 C37.1 C38.1 C39.1 C40.1 C41.1 C42.1 CN1.1(-) CN1.3 CN1.4 CN6.1(-) CN6.3 CN6.4 CN9.2(-) CN10.2(-) CN11.2(-) D1.2(A) D2.2(A) D3.2(A) D8.2(A) H10.3 LED1.1(C) Q3.2(S) Q5.2(E) R2.1 R3.1 R4.1 R8.2 R9.2 R10.3 R16.1 R18.1 R19.1 R22.2 R25.1 R27.1 R28.1 R34.1 R38.1 U1.3(GND) U1.18(GND) U1.20(STDBY) U1.25(-) U1.29(EP) U3.2(GND) U3.8(S) U27.7(GND) U27.9(EP) U28.7(GND) U28.9(EP) U30.7(GND) U30.9(EP) U33.5(VCC+)
VIN: CN1.2(+) SW1.1 SW1.2
CANH: H3.1 H4.1 H5.1 H6.1 R21.2 U3.7(CANH)
CANL: H3.2 H4.2 H5.2 H6.2 R21.1 U3.6(CANL)
CANRX: H2.2 U3.4(RXD)
CANTX: H2.1 U3.1(TXD)
DIR: H7.4 U1.19(DIR)
EN: H7.1 R23.1 U1.2(ENN)
MS1: H7.2 U1.9(MS1_AD0)
MS2: H7.3 U1.10(MS2_AD1)
OA1: H9.2 U1.24(OA1)
OA2: H9.1 U1.21(OA2)
OB1: H9.3 U1.26(OB1)
OB2: H9.4 U1.1(OB2)
SPREAD: H10.2 U1.7(SPREAD)
STEP: H7.5 U1.16(STEP)
UBAT: R32.2 SW1.3 SW1.4 U35.3(S)
VS: C39.2 C40.2 C41.2 C42.2 CN10.1(+) L3.2 R26.2
$1N2057: R3.2 U27.4(RT/CLK)
$1N2062: C5.1 U27.1(BOOT)
$1N2064: R1.1 R2.2 U27.3(EN)
$1N2070: C7.2 R6.2 U27.6(COMP)
$1N2071: R4.2 R5.1 U27.5(FB)
$1N2072: C6.2 R6.1
$1N2073: C5.2 D1.1(K) L1.1 U27.8(SW)
$1N3950: C12.2 U1.5(CPI)
$1N3978: C12.1 U1.4(CPO)
$1N4053: C13.2 U1.6(VCP)
$1N4165: LED1.2(A) R7.1
$1N4399: R10.2 U1.17(VREF)
$1N4638: R8.1 U1.23(BRA)
$1N4642: R9.1 U1.27(BRB)
$1N6180: R16.2 U28.4(RT/CLK)
$1N6185: C20.1 U28.1(BOOT)
$1N6187: R19.2 R20.1 U28.3(EN)
$1N6193: C25.2 R15.2 U28.6(COMP)
$1N6194: R17.1 R18.2 U28.5(FB)
$1N6195: C26.2 R15.1
$1N6196: C20.2 D2.1(K) L2.1 U28.8(SW)
$1N8704: LED2.1(C) R22.1
$1N11163: R28.2 R29.1 U30.3(EN)
$1N11164: C34.2 R24.1
$1N11165: C32.1 U30.1(BOOT)
$1N11166: C32.2 D3.1(K) L3.1 U30.8(SW)
$1N11168: R26.1 R27.2 U30.5(FB)
$1N11169: C33.2 R24.2 U30.6(COMP)
$1N11170: R25.2 U30.4(RT/CLK)
$1N13050: Q3.3(D) R37.1 R38.2
$1N13125: Q3.1(G) R39.1 R40.2 U33.1(OUT)
$1N13319: Q5.1(B) R40.1
$1N13408: Q5.3(C) R41.1 U34.1(G)
$1N13756: R32.1 R33.2 U35.1(G)
$1N13895: R39.2 R41.2 R42.2 U33.2(VCC-) U34.3(S) U35.2(D)
$1N13934: R35.2 R42.1 U33.4(IN+)
$1N13952: R34.2 R35.1
$1N14002: R37.2 R43.1 U33.3(IN-)
$1N14008: D8.1(K) R33.1 R43.2

Not connected (* = marked no-connect by the designer): U1 11(DIAG)* 12(INDEX)* 13(CLK)* 14(PDN_UART)*; U41 1*; U42 1*

## Notes on the sheet
- CAN收发器
  默认高速CAN，接入末端电阻
- 16.8V转12V
- 16.8V转5V
- 16.8V转5V
- 电池反接、过放保护电路
- TMC2209步进驱动模块
- 默认关闭 驱动模块
